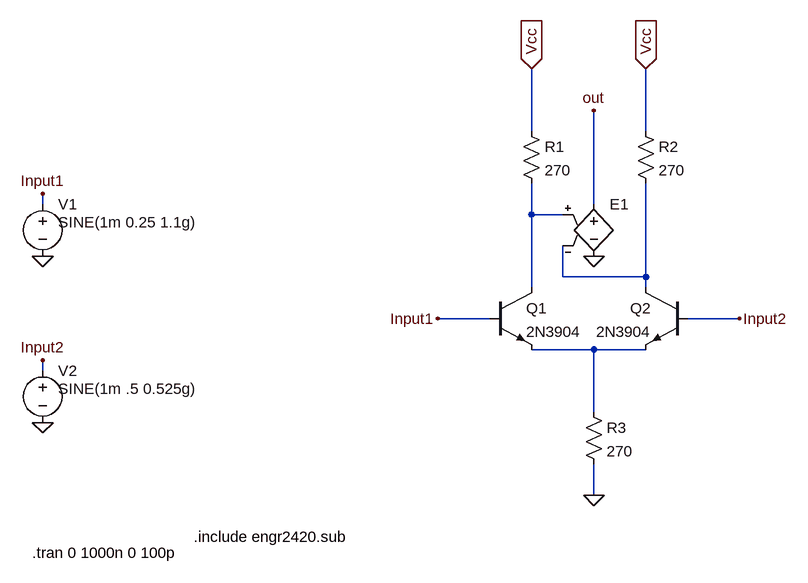
[diagram p0: schematic DiffAmp_Mixer.asc]
DiffAmp_Mixer.asc, the LTspice schematic file:
Version 4
SHEET 1 880 692
WIRE -64 -48 -64 -144
WIRE 112 -48 112 -144
WIRE -816 64 -816 48
WIRE 32 64 32 -80
WIRE -64 80 -64 32
WIRE -16 80 -64 80
WIRE -16 176 -16 128
WIRE 112 176 112 32
WIRE 112 176 -16 176
WIRE -64 192 -64 80
WIRE 112 192 112 176
WIRE -128 240 -208 240
WIRE 256 240 176 240
WIRE 32 288 -64 288
WIRE 112 288 32 288
WIRE -816 320 -816 304
WIRE 32 384 32 288
WIRE 32 512 32 464
FLAG 32 512 0
FLAG -64 -144 Vcc
IOPIN -64 -144 In
FLAG 112 -144 Vcc
IOPIN 112 -144 In
FLAG 32 144 0
FLAG 32 -80 out
FLAG -208 240 Input1
FLAG 256 240 Input2
FLAG -816 144 0
FLAG -816 400 0
FLAG -816 48 Input1
FLAG -816 304 Input2
SYMBOL npn -128 192 R0
SYMATTR InstName Q1
SYMATTR Value 2N3904
SYMBOL npn 176 192 M0
SYMATTR InstName Q2
SYMATTR Value 2N3904
SYMBOL res -80 -64 R0
SYMATTR InstName R1
SYMATTR Value 270
SYMBOL res 96 -64 R0
SYMATTR InstName R2
SYMATTR Value 270
SYMBOL res 16 368 R0
SYMATTR InstName R3
SYMATTR Value 270
SYMBOL e 32 48 R0
WINDOW 3 24 96 Invisible 2
SYMATTR Value 1
SYMATTR InstName E1
SYMBOL voltage -816 48 R0
WINDOW 3 24 44 Left 2
WINDOW 123 24 72 Left 2
WINDOW 39 0 0 Left 0
SYMATTR Value SINE(1m 0.25 1.1g)
SYMATTR InstName V1
SYMBOL voltage -816 304 R0
WINDOW 3 24 44 Left 2
WINDOW 39 0 0 Left 0
SYMATTR Value SINE(1m .5 0.525g)
SYMATTR InstName V2
TEXT -584 576 Left 2 !.include engr2420.sub
TEXT -832 600 Left 2 !.tran 0 1000n 0 100p

The netlist it stands for:
* DiffAmp_Mixer.asc
Q1 N001 Input1 N003 0 2N3904
Q2 N002 Input2 N003 0 2N3904
R1 Vcc N001 270
R2 Vcc N002 270
R3 N003 0 270
E1 out 0 N001 N002 1
V1 Input1 0 SINE(1m 0.25 1.1g)
V2 Input2 0 SINE(1m .5 0.525g)
.model NPN NPN
.model PNP PNP
.lib standard.bjt
.include engr2420.sub
.tran 0 1000n 0 100p
.backanno
.end